# EAGLE schematic schematic (EAGLE 6.3)
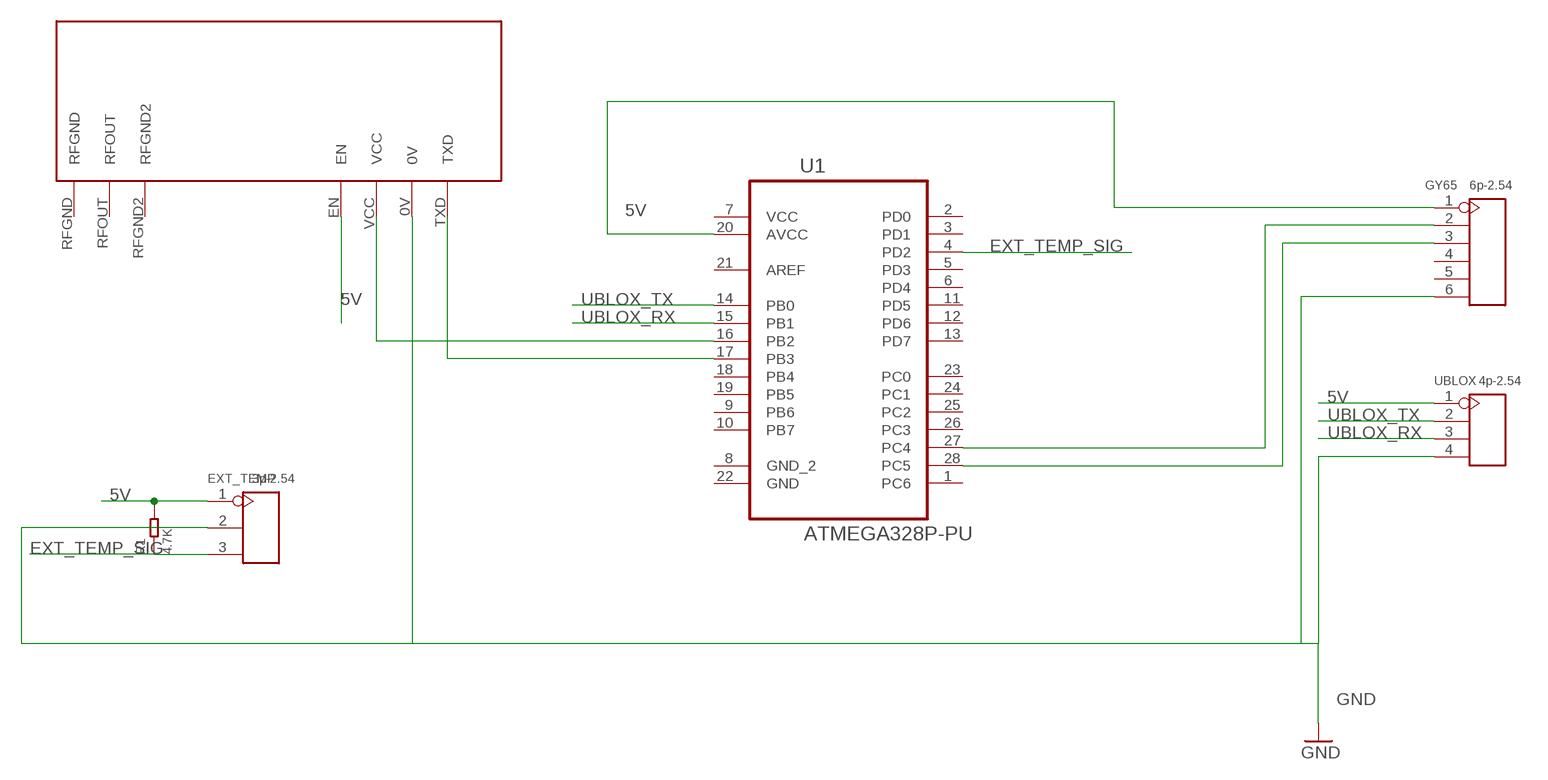
[diagram p0: schematic, sheet 1]

## Parts
EXT_TEMP  3p-2.54  DIP-BLACK-MALE-HEADER-VERT(3P-2.54)  [H3-2.54]
GY65  6p-2.54  DIP-BLACK-FEMALE-HEADER-VERT(6P-2.54)  [H6-2.54]
R1  4.7K  SMD-RES-4.7K-5%-1/16W(0402)  [R0402]
U1  ATMEGA328P-PU  [DIP254P762X457-28]
U$1  RADIOMETRIX-HX1  [RADIOMETRIX-HX1]
UBLOX  4p-2.54  DIP-BLACK-FEMALE-HEADER-VERT(4P-2.54)  [H4-2.54]

## Nets
5V: EXT_TEMP.1 GY65.1 R1.2 U1.20(AVCC) U$1.EN UBLOX.1
EXT_TEMP_SIG: EXT_TEMP.3 R1.1 U1.4(PD2)
GND: EXT_TEMP.2 GY65.6 U$1.0V UBLOX.4
GY65-S1: GY65.2 U1.27(PC4)
N$1: U1.17(PB3) U$1.TXD
N$2: U1.16(PB2) U$1.VCC
N$6: GY65.3 U1.28(PC5)
UBLOX_RX: U1.15(PB1) UBLOX.3
UBLOX_TX: U1.14(PB0) UBLOX.2
Unconnected: GY65.4 GY65.5 U1.1(PC6) U1.2(PD0) U1.3(PD1) U1.5(PD3) U1.6(PD4) U1.8(GND_2) U1.9(PB6) U1.10(PB7) U1.11(PD5) U1.12(PD6) U1.13(PD7) U1.18(PB4) U1.19(PB5) U1.21(AREF) U1.22(GND) U1.23(PC0) U1.24(PC1) U1.25(PC2) U1.26(PC3) U$1.RFGND U$1.RFGND2 U$1.RFOUT

## Power pins joined to a net without a drawn wire
VCC: U1.7(VCC)

## Library data of the parts
EXT_TEMP = Seeed-Connector -2016:DIP-BLACK-MALE-HEADER-VERT(3P-2.54): 320020079
GY65 = Seeed-Connector -2016:DIP-BLACK-FEMALE-HEADER-VERT(6P-2.54): 320030060; MPN: F185-1106A1BSYC1
R1 = Seeed-Resistor-2016:SMD-RES-4.7K-5%-1/16W(0402): 301010010; MPN: RC0402JR-074K7L
U1 = Atmel_By_element14_Batch_1-00:ATMEGA328P-PU: 8-bit Microcontroller with In-System Programmable Flash; MPN: ATMEGA328P-PU; OC_FARNELL: 1715487; OC_NEWARK: 15R0268; PACKAGE: PDIP-28; SUPPLIER: Atmel
U$1 = Ava:RADIOMETRIX-HX1
UBLOX = Seeed-Connector -2016:DIP-BLACK-FEMALE-HEADER-VERT(4P-2.54): 320030017; MPN: F185-1104A1BSYA1